# EAGLE design ckt diagram 5v Ac-Dc (EAGLE 9.6.2)
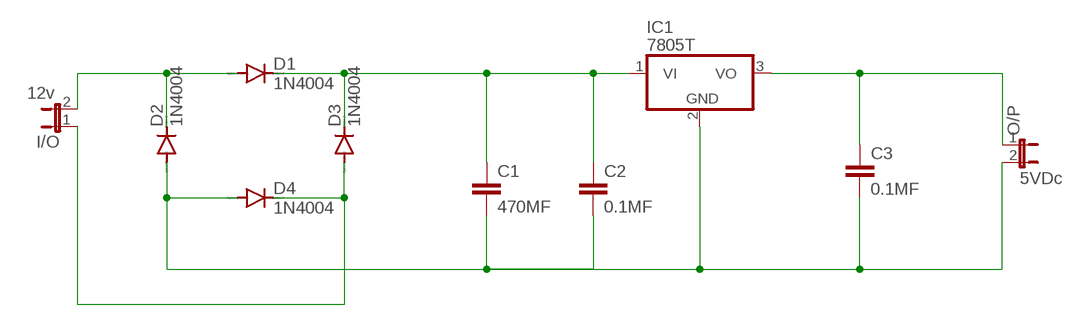
[diagram p0: schematic, sheet 1]

## Parts
C1  470MF  C2.5/2  [C2.5-2]
C2  0.1MF  C2.5/2  [C2.5-2]
C3  0.1MF  C2.5/2  [C2.5-2]
D1  1N4004  [DO41-10]
D2  1N4004  [DO41-10]
D3  1N4004  [DO41-10]
D4  1N4004  [DO41-10]
I/O  12v  JP1E  [JP1]
IC1  7805T  [TO220H]
O/P  5VDc  JP1E  [JP1]

## Nets
N$1: D1.A D2.C I/O.2
N$2: C1.2 C2.2 C3.2 D2.A D4.A IC1.2(GND) O/P.2
N$3: D3.A D4.C I/O.1
N$4: C1.1 C2.1 D1.C D3.C IC1.1(VI)
N$6: C3.1 IC1.3(VO) O/P.1

## Library data of the parts
C1-C3 = capacitor-wima:C: CAPACITOR naming: grid - package width
D1-D4 = diode:1N4004: DIODE general purpose rectifier, 1 A
I/O O/P = jumper:JP1E: JUMPER
IC1 = adafruit:78*: Positive VOLTAGE REGULATOR Added bigger pads to the TO-92 package

## Board
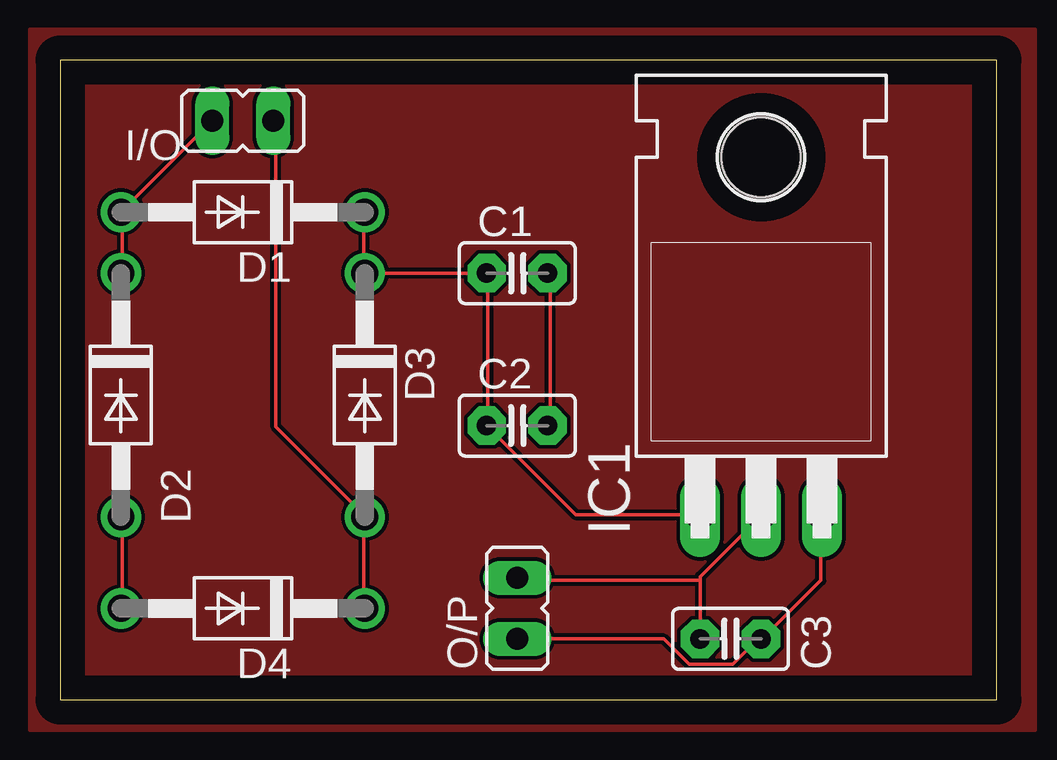
[diagram p1: board, top side]
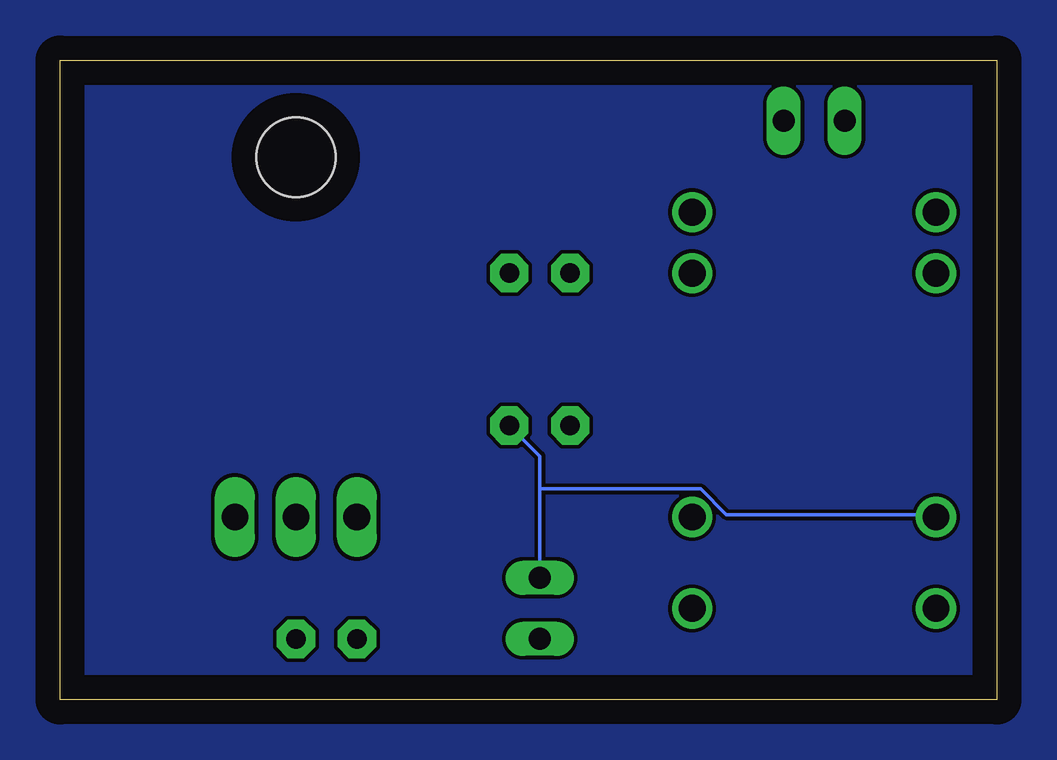
[diagram p2: board, bottom side, seen from below]

Size 39.04 x 26.66 mm. Coordinates in mm from the lower left corner, seen from the top.
Outline: 0,0 39.04,0 39.04,26.66 0,26.66 0,0
Copper layers (1*16): Top 0.035mm / dielectric 1.5mm / Bottom 0.035mm
Design rules "default": minimum track width 6mil, minimum drill 0.35mm, track to track 6mil, track to pad 6mil, pad to pad 6mil, via to via 6mil, smd to smd 6mil, copper to edge 40mil, drill to drill 6mil, minimum pad ring 10mil, minimum via ring 8mil, stop-mask expansion 4mil, vias tented up to drill 0mil, thermal gap 10mil

### Footprints (pad centres in the part's own frame; a part is rotated, then mirrored left to right if it is on the bottom)
C2.5-2 = drill 0.813 pad 1.6 octagon: 1 -1.27,0; 2 1.27,0
DO41-10 = drill 1.118: A 5.08,0; C -5.08,0
JP1 = drill 0.914 long: 1 0,-1.27; 2 0,1.27
TO220H = drill 1.118 long: 1 -2.54,-10.16; 2 0,-10.16; 3 2.54,-10.16 | hole 3.302: 0,4.826

### Placement (x,y rotation side)
C1  19.05,17.78 0 top
C2  19.05,11.43 0 top
C3  27.94,2.54 180 top
D1  7.62,20.32 180 top
D2  2.54,12.7 270 top
D3  12.7,12.7 270 top
D4  7.62,3.81 180 top
I/O  7.62,24.13 90 top
IC1  29.21,17.78 0 top
O/P  19.05,3.81 0 top

### Tracks (layer width: path | path; a pad name or v marks a point on that pad's centre or on a via)
GND
  pour Top: -1.27,27.94 40.64,27.94 40.64,-1.27 -1.27,-1.27
  pour Bottom: -2.54,29.21 41.91,29.21 41.91,-2.54 -2.54,-2.54
N$1
  Top 0.152: I/O.2 D1.A 2.59,20.22 2.59,17.78 D2.C
N$2
  Top 0.152: 26.67,4.98 26.67,5.13 29.11,7.57 IC1.2 | 26.67,4.98 C3.2 | D4.A 2.59,3.91 2.59,7.57 D2.A | C1.2 20.42,17.78 20.42,11.53 C2.2 | 26.67,4.98 19.05,4.98 O/P.2
  Bottom 0.152: 19.05,8.79 19.05,10.16 C2.2 | 19.05,8.79 O/P.2 | 19.05,8.79 12.34,8.79 11.28,7.72 2.59,7.72 D2.A
N$3
  Top 0.152: I/O.1 8.99,24.03 8.99,11.38 12.65,7.72 D3.A 12.65,7.57 12.65,3.91 D4.C
N$4
  Top 0.152: D1.C 12.65,20.22 12.65,17.78 D3.C C1.1 17.83,17.78 17.83,11.53 C2.1 21.49,7.72 26.67,7.72 IC1.1
N$6
  Top 0.152: O/P.1 25.15,2.54 26.21,1.47 28.04,1.47 29.11,2.54 C3.1 29.26,2.54 31.7,4.98 31.7,7.57 IC1.3